# Altium schematic sheet D_OUTPUT.SchDoc
size A; SheetNumber: 3; SheetTotal: 9
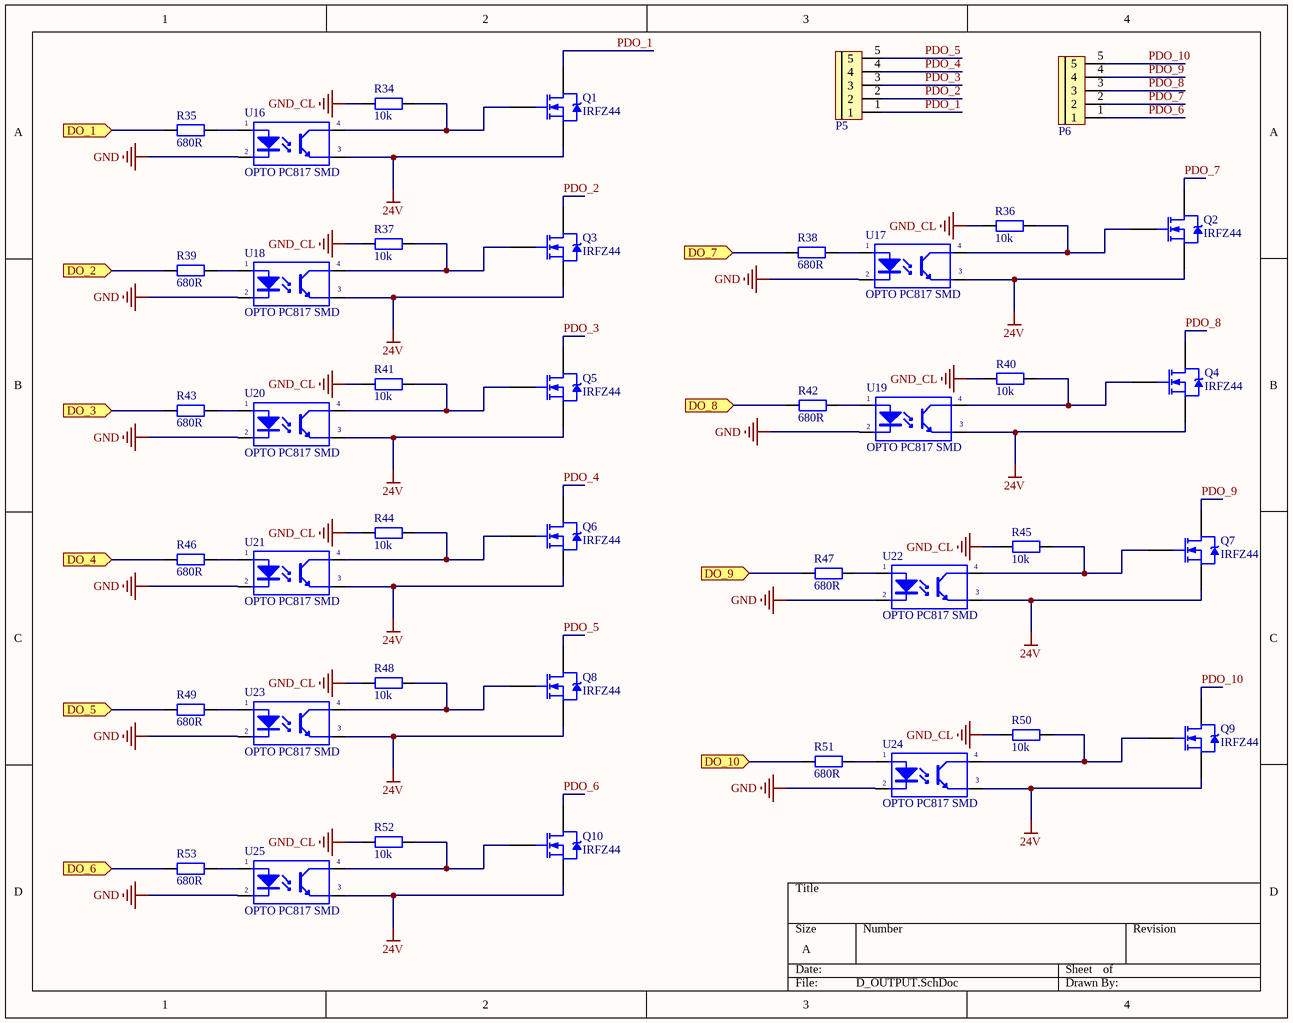
[diagram p0: D_OUTPUT.SchDoc]

## Parts
P5  CON 5 EDG5.08  [CON 5 5EDG5.08]  (value not drawn)
P6  CON 5 EDG5.08  [CON 5 5EDG5.08]  (value not drawn)
Q1  IRFZ44  [TO220]
Q2  IRFZ44  [TO220]
Q3  IRFZ44  [TO220]
Q4  IRFZ44  [TO220]
Q5  IRFZ44  [TO220]
Q6  IRFZ44  [TO220]
Q7  IRFZ44  [TO220]
Q8  IRFZ44  [TO220]
Q9  IRFZ44  [TO220]
Q10  IRFZ44  [TO220]
R34  10k  [tro smd 0805]
R35  680R  [Tro SMD 0805]
R36  10k  [tro smd 0805]
R37  10k  [tro smd 0805]
R38  680R  [Tro SMD 0805]
R39  680R  [Tro SMD 0805]
R40  10k  [tro smd 0805]
R41  10k  [tro smd 0805]
R42  680R  [Tro SMD 0805]
R43  680R  [Tro SMD 0805]
R44  10k  [tro smd 0805]
R45  10k  [tro smd 0805]
R46  680R  [Tro SMD 0805]
R47  680R  [Tro SMD 0805]
R48  10k  [tro smd 0805]
R49  680R  [Tro SMD 0805]
R50  10k  [tro smd 0805]
R51  680R  [Tro SMD 0805]
R52  10k  [tro smd 0805]
R53  680R  [Tro SMD 0805]
U16  OPTO PC817 SMD  [SOP4]
U17  OPTO PC817 SMD  [SOP4]
U18  OPTO PC817 SMD  [SOP4]
U19  OPTO PC817 SMD  [SOP4]
U20  OPTO PC817 SMD  [SOP4]
U21  OPTO PC817 SMD  [SOP4]
U22  OPTO PC817 SMD  [SOP4]
U23  OPTO PC817 SMD  [SOP4]
U24  OPTO PC817 SMD  [SOP4]
U25  OPTO PC817 SMD  [SOP4]

## Ports
DO_1 (in), DO_2 (in), DO_3 (in), DO_4 (in), DO_5 (in), DO_6 (in), DO_7 (in), DO_8 (in), DO_9 (in), DO_10 (in)

## Nets
24V: Q1.3(S) Q2.3(S) Q3.3(S) Q4.3(S) Q5.3(S) Q6.3(S) Q7.3(S) Q8.3(S) Q9.3(S) Q10.3(S) U16.3(E) U17.3(E) U18.3(E) U19.3(E) U20.3(E) U21.3(E) U22.3(E) U23.3(E) U24.3(E) U25.3(E)
GND: U16.2(K) U17.2(K) U18.2(K) U19.2(K) U20.2(K) U21.2(K) U22.2(K) U23.2(K) U24.2(K) U25.2(K)
GND_CL: R34.1 R36.1 R37.1 R40.1 R41.1 R44.1 R45.1 R48.1 R50.1 R52.1
DO_1: R35.1 ; port DO_1
DO_2: R39.1 ; port DO_2
DO_3: R43.1 ; port DO_3
DO_4: R46.1 ; port DO_4
DO_5: R49.1 ; port DO_5
DO_6: R53.1 ; port DO_6
DO_7: R38.1 ; port DO_7
DO_8: R42.1 ; port DO_8
DO_9: R47.1 ; port DO_9
DO_10: R51.1 ; port DO_10
PDO_1: P5.1 Q1.2(D)
PDO_2: P5.2 Q3.2(D)
PDO_3: P5.3 Q5.2(D)
PDO_4: P5.4 Q6.2(D)
PDO_5: P5.5 Q8.2(D)
PDO_6: P6.1 Q10.2(D)
PDO_7: P6.2 Q2.2(D)
PDO_8: P6.3 Q4.2(D)
PDO_9: P6.4 Q7.2(D)
PDO_10: P6.5 Q9.2(D)
NetQ1_1: Q1.1(G) R34.2 U16.4(C)
NetQ2_1: Q2.1(G) R36.2 U17.4(C)
NetQ3_1: Q3.1(G) R37.2 U18.4(C)
NetQ4_1: Q4.1(G) R40.2 U19.4(C)
NetQ5_1: Q5.1(G) R41.2 U20.4(C)
NetQ6_1: Q6.1(G) R44.2 U21.4(C)
NetQ7_1: Q7.1(G) R45.2 U22.4(C)
NetQ8_1: Q8.1(G) R48.2 U23.4(C)
NetQ9_1: Q9.1(G) R50.2 U24.4(C)
NetQ10_1: Q10.1(G) R52.2 U25.4(C)
NetR35_2: R35.2 U16.1(A)
NetR38_2: R38.2 U17.1(A)
NetR39_2: R39.2 U18.1(A)
NetR42_2: R42.2 U19.1(A)
NetR43_2: R43.2 U20.1(A)
NetR46_2: R46.2 U21.1(A)
NetR47_2: R47.2 U22.1(A)
NetR49_2: R49.2 U23.1(A)
NetR51_2: R51.2 U24.1(A)
NetR53_2: R53.2 U25.1(A)

## Library data of the parts
P5 P6 = CON 5 EDG5.08: Cắm; Ten_Linh_Kien: CON 5 2EDG5.08-5P 5.08MM ( Xanh Cong); Ma_Hang: MH003589; Kieu_Chan: *; Don_Vi: Con; Ghi_Chu: *; Chung_Loai: Cắm
Q1-Q10 = IRFZ44 DIP: N-Channel Power MOSFET
R34 R36 R37 R40 R41 R44 R45 R48 R50 R52 = Tro 0805 5% 10k: Dán; Don_Vi: Con; So_Chan: 2; Ten_Linh_Kien: Trở 0805 5% 10k; Ma_Hang: MH005239; Chung_Loai: Dán; Kieu_Chan: *
R35 R38 R39 R42 R43 R46 R47 R49 R51 R53 = Tro 0805 5% 680R: Dán; Don_Vi: Con; Ma_Hang: MH005344; So_Chan: 2; Ten_Linh_Kien: Trở 0805 5% 680R; Chung_Loai: Dán; Kieu_Chan: *
U16-U25 = OPTO PC817 SMD: Single Opto; Value: PC817